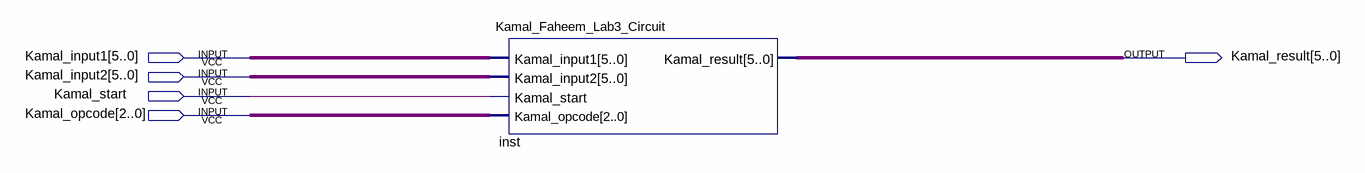
[diagram p0: schematic sheet]
// Quartus schematic Kamal_Faheem_Lab3_Bitwise.bdf as structural Verilog: 1 symbols, 5 pins
module Kamal_Faheem_Lab3_Bitwise (
  input  [5:0] Kamal_input1,
  input  [5:0] Kamal_input2,
  input  Kamal_start,
  input  [2:0] Kamal_opcode,
  output [5:0] Kamal_result
);

  Kamal_Faheem_Lab3_Circuit inst (
    .Kamal_input1(Kamal_input1), .Kamal_input2(Kamal_input2), .Kamal_start(Kamal_start),
    .Kamal_opcode(Kamal_opcode), .Kamal_result(Kamal_result));
endmodule
